# EAGLE schematic carte_moteurs_robotech (EAGLE 8.5.2)
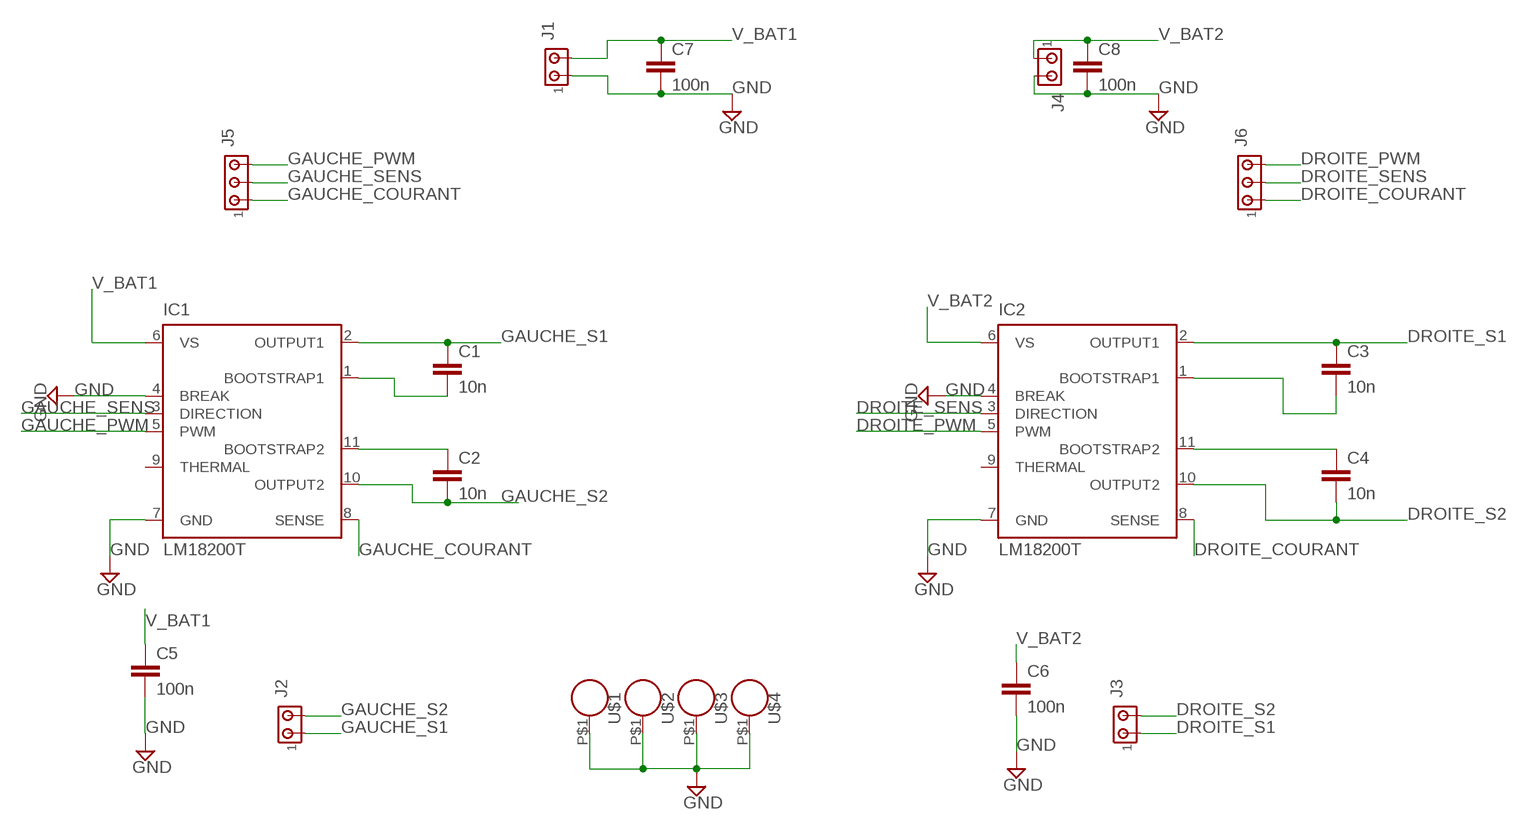
[diagram p0: schematic, sheet 1]

## Parts
C1  10n  C7.5/3  [C7.5B3]
C2  10n  C7.5/3  [C7.5B3]
C3  10n  C7.5/3  [C7.5B3]
C4  10n  C7.5/3  [C7.5B3]
C5  100n  C7.5/3  [C7.5B3]
C6  100n  C7.5/3  [C7.5B3]
C7  100n  C7.5/3  [C7.5B3]
C8  100n  C7.5/3  [C7.5B3]
IC1  LM18200T  [TO-220-11]
IC2  LM18200T  [TO-220-11]
J1  MTA02-156  [1X2MTA]
J2  MTA02-156  [1X2MTA]
J3  MTA02-156  [1X2MTA]
J4  MTA02-156  [1X2MTA]
J5  MTA03-156  [1X3MTA]
J6  MTA03-156  [1X3MTA]
U$1  DRILL3META  [DRILL3ME]
U$2  DRILL3META  [DRILL3ME]
U$3  DRILL3META  [DRILL3ME]
U$4  DRILL3META  [DRILL3ME]

## Nets
DROITE_COURANT: IC2.8(SENSE) J6.1
DROITE_PWM: IC2.5(PWM) J6.3
DROITE_S1: C3.1 IC2.2(OUTPUT1) J3.1
DROITE_S2: C4.2 IC2.10(OUTPUT2) J3.2
DROITE_SENS: IC2.3(DIRECTION) J6.2
GAUCHE_COURANT: IC1.8(SENSE) J5.1
GAUCHE_PWM: IC1.5(PWM) J5.3
GAUCHE_S1: C1.1 IC1.2(OUTPUT1) J2.1
GAUCHE_S2: C2.2 IC1.10(OUTPUT2) J2.2
GAUCHE_SENS: IC1.3(DIRECTION) J5.2
GND: C5.2 C6.2 C7.2 C8.2 IC1.4(BREAK) IC1.7(GND) IC2.4(BREAK) IC2.7(GND) J1.1 J4.2 U$1.P$1(P) U$2.P$1(P) U$3.P$1(P) U$4.P$1(P)
N$2: C1.2 IC1.1(BOOTSTRAP1)
N$3: C2.1 IC1.11(BOOTSTRAP2)
N$8: C3.2 IC2.1(BOOTSTRAP1)
N$9: C4.1 IC2.11(BOOTSTRAP2)
V_BAT1: C5.1 C7.1 IC1.6(VS) J1.2
V_BAT2: C6.1 C8.1 IC2.6(VS) J4.1
Unconnected: IC1.9(THERMAL) IC2.9(THERMAL)

## Library data of the parts
C1-C8 = capacitor-wima:C: CAPACITOR naming: grid - package width
IC1 IC2 = national-semiconductor:LM18200T: 3A, 55V H-Bridge Motor Control SourcE: http://cache.national.com/ds/LM/LMD18200.pdf; OC_FARNELL: unknown; OC_NEWARK: unknown
J1-J4 = con-amp:MTA02-156: AMP connector
J5 J6 = con-amp:MTA03-156: AMP connector
U$1-U$4 = Eudil:DRILL3META